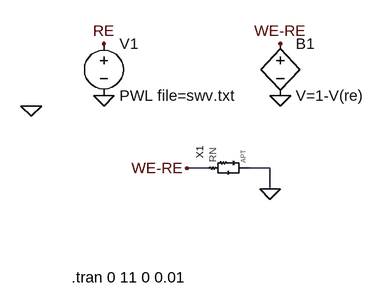
[diagram p0: schematic Randles_Tester.asc]
Randles_Tester.asc, the LTspice schematic file:
Version 4
SHEET 1 880 680
WIRE 272 96 240 96
WIRE 368 96 336 96
WIRE 368 128 368 96
FLAG 112 -16 0
FLAG 112 -96 RE
FLAG 240 96 WE-RE
FLAG 368 128 0
FLAG 384 -96 WE-RE
FLAG 384 -16 0
FLAG 0 0 0
SYMBOL voltage 112 -112 R0
WINDOW 123 0 0 Left 0
WINDOW 39 0 0 Left 0
SYMATTR InstName V1
SYMATTR Value PWL file=swv.txt
SYMBOL randles 272 112 R270
SYMATTR InstName X1
SYMBOL bv 384 -112 R0
SYMATTR InstName B1
SYMATTR Value V=1-V(re)
TEXT 62 264 Left 2 !.tran 0 11 0 0.01

The netlist it stands for:
* Randles_Tester.asc
V1 RE 0 PWL file=swv.txt
XX1 WE-RE 0 randles  ; pins A B
B1 WE-RE 0 V=1-V(re)
.tran 0 11 0 0.01
.backanno
.end